# EAGLE board Front ECU rev7 (EAGLE 8.3.1)
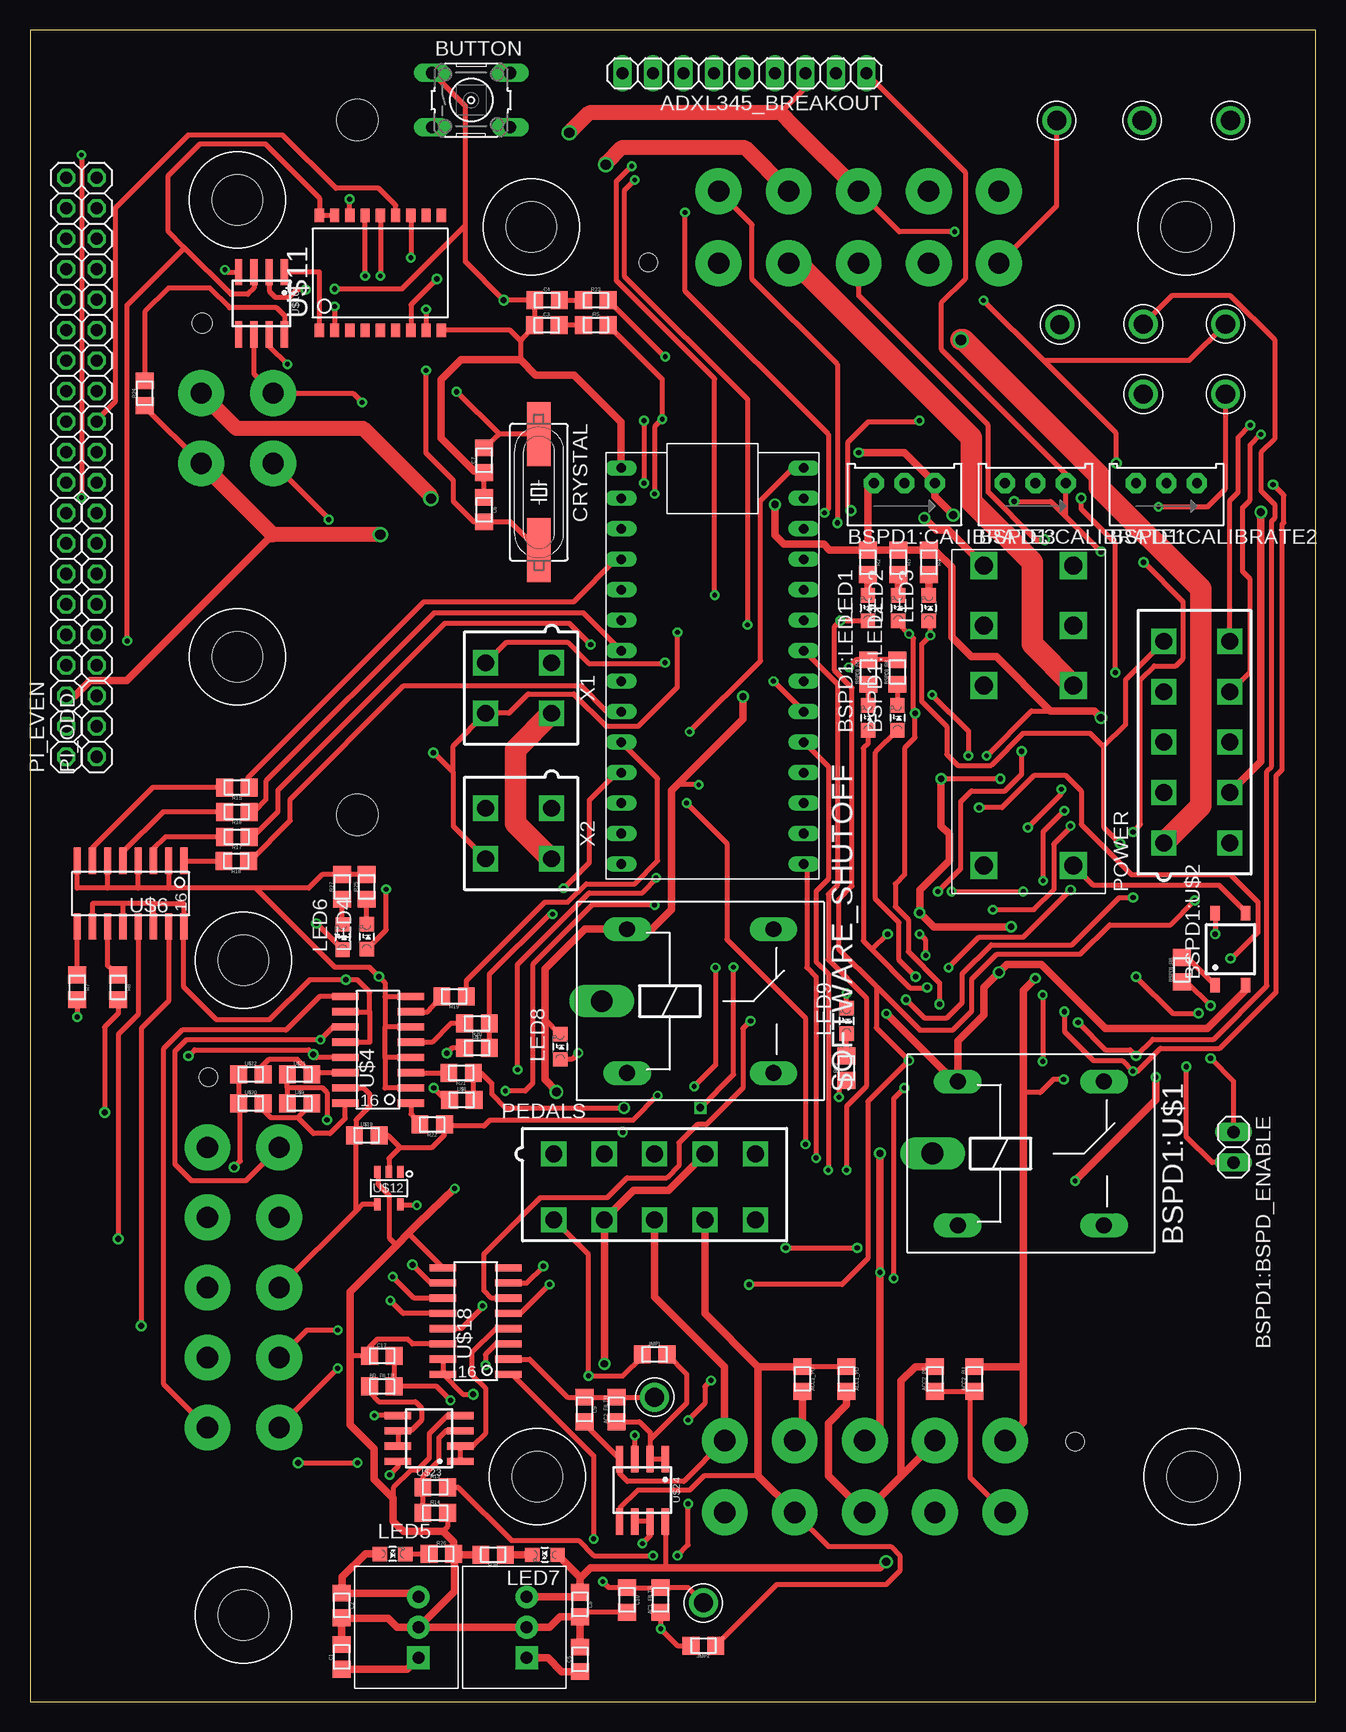
[diagram p2: board, top side]
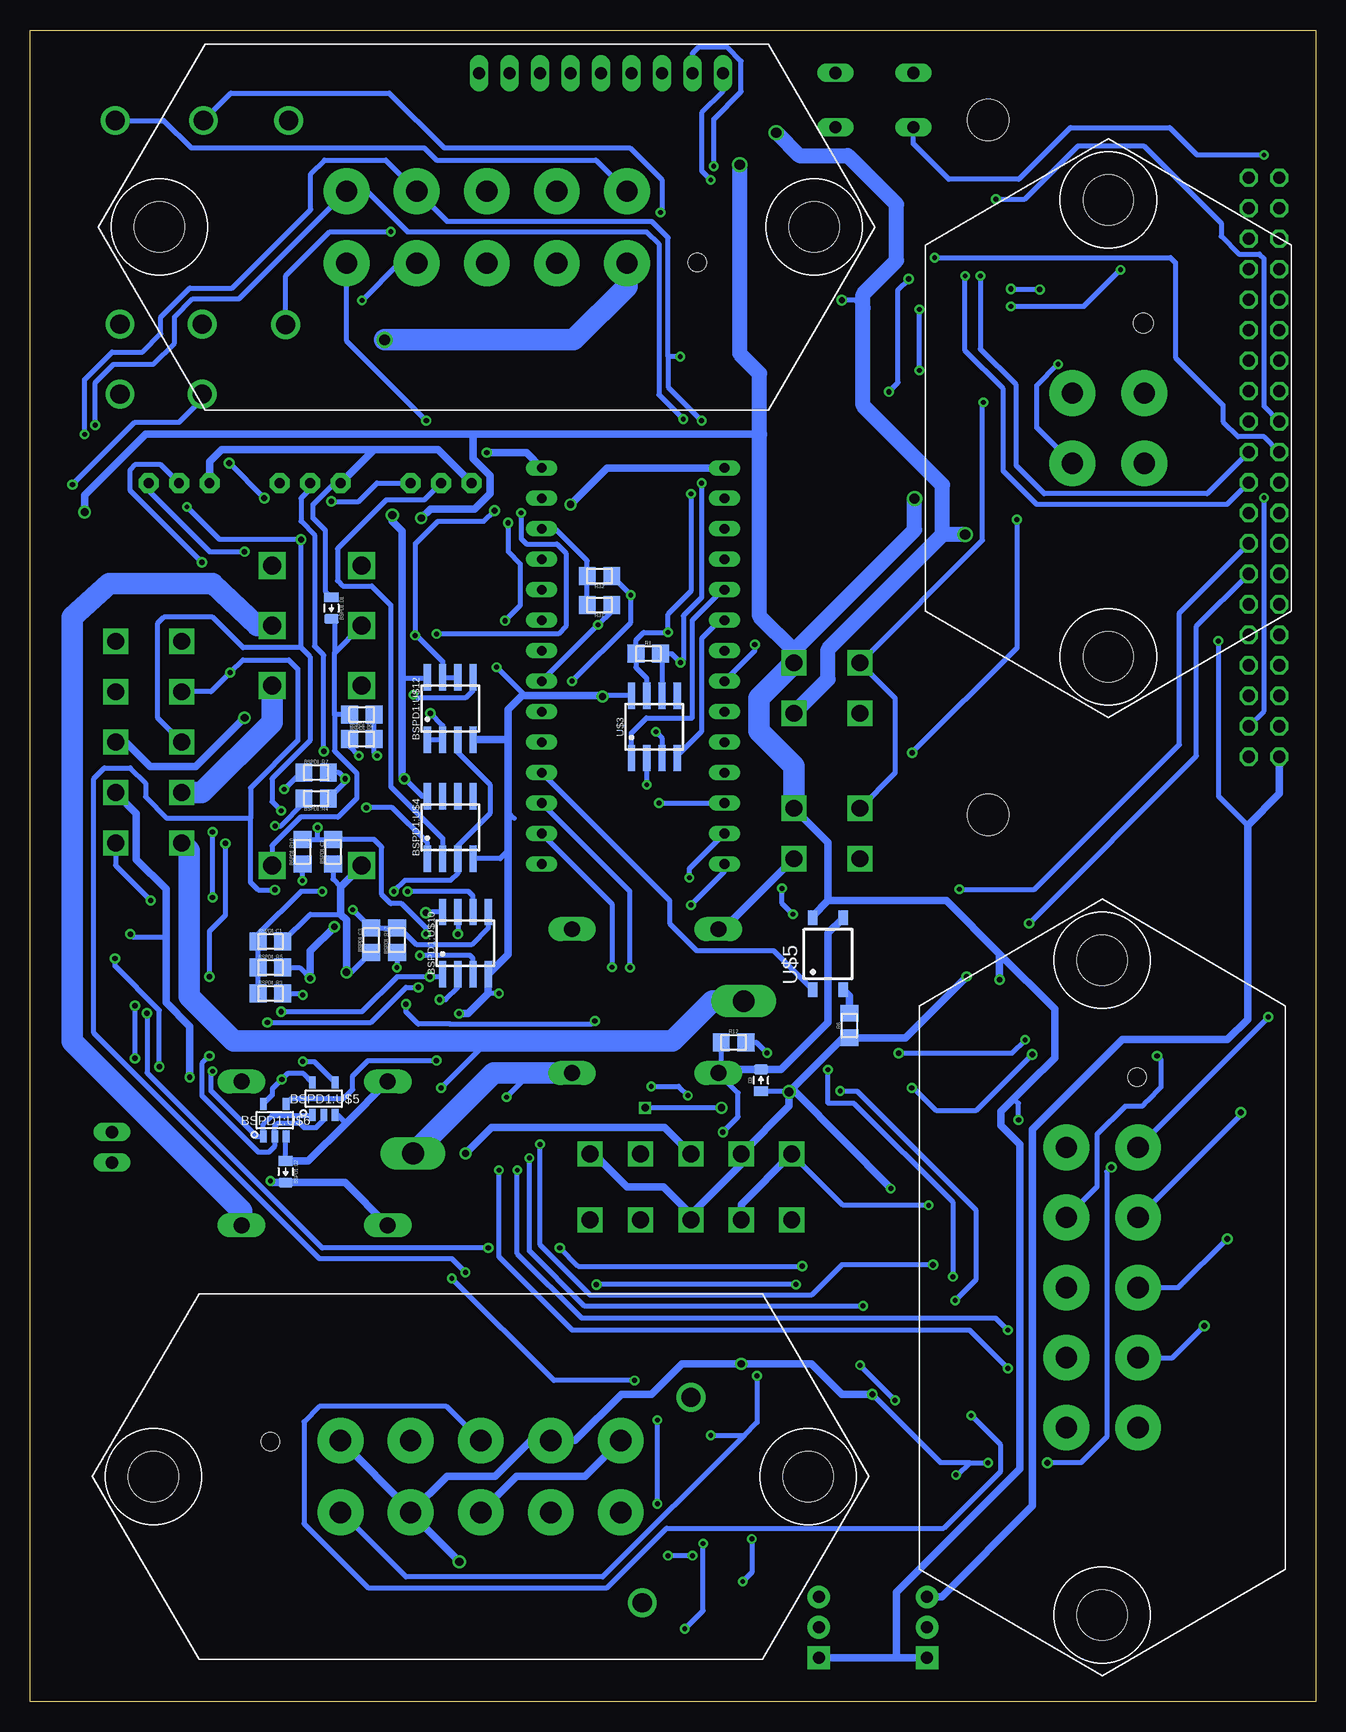
[diagram p3: board, bottom side, seen from below]

Size 107.17 x 139.37 mm. Coordinates in mm from the lower left corner, seen from the top.
Outline: 0,0 107.17,0 107.17,139.37 0,139.37 0,0
Copper layers (1*16): Top 0.035mm / dielectric 1.5mm / Bottom 0.035mm
Design rules "DRC Advanced Circuits": minimum track width 6mil, minimum drill 15mil, track to track 6mil, track to pad 6mil, pad to pad 6mil, via to via 6mil, smd to smd 6mil, copper to edge 40mil, drill to drill 6mil, minimum pad ring 10mil, minimum via ring 8mil, stop-mask expansion 4mil, vias tented up to drill 0mil, thermal gap 10mil
Holes 3.43 mm at 27.28,131.88 27.28,73.96
tKeepout: area 23,69.7 to 31.4,78.1; area 23.1,127.6 to 31.5,136

## Footprints (pad centres in the part's own frame; a part is rotated, then mirrored left to right if it is on the bottom)
0805 = smd 1.4 x 1.5: 1 -1.025,0; 2 1.025,0
1X09 = drill 1.016 long: 1 -8.89,0; 2 -6.35,0; 3 -3.81,0; 4 -1.27,0; 5 1.27,0; 6 3.81,0; 7 6.35,0; 8 8.89,0; 9 11.43,0
1X02 = drill 1.016 long: 1 -1.27,0; 2 1.27,0
TRIMPOT_3296 = drill 0.813 pad 1.676 octagon: 1 2.54,1.27; 2 0,1.27; 3 -2.54,1.27
0805_D = smd 0.8 x 1.2: A -0.9,0; C 0.9,0
LED-805 = smd 1.2 x 1.2: A 0,-1.05; C 0,1.05
ZF112 = drill 1.321 long: 1 4.064,14.884; 2 4.064,2.896; O 16.256,14.884; S 16.256,2.896 | drill 1.803 long: P 1.956,8.89
SOP04 = smd 0.8 x 1.2: 1 -1.27,-3; 2 1.27,-3; 3 1.27,3; 4 -1.27,3
JW2SN = drill 1.5 square: 2 10.008,0; 3 5.004,0; 4 0,0; 5 0,7.493; 6 5.004,7.493; 7 10.008,7.493; COIL+ 25.019,0; COIL- 25.019,7.493
SOIC-08 = smd 0.6 x 2.2: 1 -1.905,-2.6; 2 -0.635,-2.6; 3 0.635,-2.6; 4 1.905,-2.6; 5 1.905,2.6; 6 0.635,2.6; 7 -0.635,2.6; 8 -1.905,2.6
SOT-23-5 = smd 1 x 0.55: 1 -1.35,0.95; 2 -1.35,0; 3 -1.35,-0.95; 4 1.35,-0.95; 5 1.35,0.95
TEST_POINT = drill 1.6: P$1 0,0
B3F-10XX = drill 1.016 long: 1 -3.251,2.261; 2 3.251,2.261; 3 -3.251,-2.261; 4 3.251,-2.261
HC49UP = smd 5.334 x 1.93: 1 -4.826,0; 2 4.826,0
OKI-78SR = drill 1 pad 1.88 square: 1 -2.54,0 | drill 1 pad 1.88: 2 0,0; 3 2.54,0
MINIFIT_5566-10 = drill 1.4 square: 1 8.4,-2.75; 2 4.2,-2.75; 3 0,-2.75; 4 -4.2,-2.75; 5 -8.4,-2.75; 6 8.4,2.75; 7 4.2,2.75; 8 0,2.75; 9 -4.2,2.75; 10 -8.4,2.75
1X20 = drill 1.016 octagon: 1 0,0; 2 2.54,0; 3 5.08,0; 4 7.62,0; 5 10.16,0; 6 12.7,0; 7 15.24,0; 8 17.78,0; 9 20.32,0; 10 22.86,0; 11 25.4,0; 12 27.94,0; 13 30.48,0; 14 33.02,0; 15 35.56,0; 16 38.1,0; 17 40.64,0; 18 43.18,0; 19 45.72,0; 20 48.26,0
TEENSY_3.2_SIMPLE = drill 0.8 long: 3.3V 16.51,29.21; A0 16.51,3.81; A1 16.51,6.35; A2 16.51,8.89; A3 16.51,11.43; A4 16.51,13.97; A5 16.51,16.51; A6 16.51,19.05; A7 16.51,21.59; A8 16.51,24.13; A9 16.51,26.67; AGND 16.51,31.75; D0(RX1) 1.27,31.75; D1(TX1) 1.27,29.21; D2 1.27,26.67; D3(CANTX) 1.27,24.13; D4(CANRX) 1.27,21.59; D5 1.27,19.05; D6 1.27,16.51; D7(RX3) 1.27,13.97; D8(TX3) 1.27,11.43; D9(RX2) 1.27,8.89; D10(TX2) 1.27,6.35; D11 1.27,3.81; D12 1.27,1.27; D13 16.51,1.27; GND 1.27,34.29; VIN 16.51,34.29
SOIC-16 = smd 0.6 x 2.2: 1 -4.445,-2.794; 2 -3.175,-2.794; 3 -1.905,-2.794; 4 -0.635,-2.794; 5 0.635,-2.794; 6 1.905,-2.794; 7 3.175,-2.794; 8 4.445,-2.794; 9 4.445,2.667; 10 3.175,2.667; 11 1.905,2.667; 12 0.635,2.667; 13 -0.635,2.667; 14 -1.905,2.667; 15 -3.175,2.667; 16 -4.445,2.667
SOIC-18W = smd 0.762 x 1.143: 1 -5.08,-4.788; 2 -3.81,-4.788; 3 -2.54,-4.788; 4 -1.27,-4.788; 5 0,-4.788; 6 1.27,-4.788; 7 2.54,-4.788; 8 3.81,-4.788; 9 5.08,-4.788; 10 5.08,4.788; 11 3.81,4.788; 12 2.54,4.788; 13 1.27,4.788; 14 0,4.788; 15 -1.27,4.788; 16 -2.54,4.788; 17 -3.81,4.788; 18 -5.08,4.788
MINIFIT_5566-4 = drill 1.4 square: 1 2.1,-2.75; 2 -2.1,-2.75; 3 2.1,2.75; 4 -2.1,2.75
MX150L_VERTICAL-4 = drill 1.778 pad 3.81: 1 -2.921,2.997; 2 2.921,2.997; 3 -2.921,-2.997; 4 2.921,-2.997 | hole 4.191: -19.05,0; 19.05,0 | hole 1.651: -8.763,2.921
MX150L_VERTICAL-10 = drill 1.778 pad 3.81: 1 -11.684,2.997; 2 -5.842,2.997; 3 0,2.997; 4 5.842,2.997; 5 11.684,2.997; 6 -11.684,-2.997; 7 -5.842,-2.997; 8 0,-2.997; 9 5.842,-2.997; 10 11.684,-2.997 | hole 4.191: -27.292,0; 27.292,0 | hole 1.524: -17.526,2.921

## Placement (x,y rotation side)
AC1_FILTR  510  [0805]  52.58,8.51 90 top
AC2_FILTR  510  [0805]  48.9,24.38 90 top
ACC1_PD  10k  [0805]  68.07,26.92 270 top
ACC1_PU  10k  [0805]  64.39,26.92 270 top
ACC2_PD  10k  [0805]  75.44,26.92 90 top
ACC2_PU  10k  [0805]  78.74,26.92 90 top
ADXL345_BREAKOUT  [1X09]  60.83,135.76 180 top
BR_FILTR  100  [0805]  29.34,26.29 0 top
BSPD1:BSPD_ENABLE  JUMPER  [1X02]  100.33,46.23 270 top
BSPD1:C1  .47µ  [0805]  87.12,63.37 0 bottom
BSPD1:C2  2.2µ  [0805]  81.92,70.87 90 bottom
BSPD1:C3  2.2µ  [0805]  78.74,63.5 90 bottom
BSPD1:CALIBRATE1  [TRIMPOT_3296]  83.82,100.33 0 top
BSPD1:CALIBRATE2  [TRIMPOT_3296]  94.74,100.33 0 top
BSPD1:CALIBRATE3  [TRIMPOT_3296]  72.9,100.33 0 top
BSPD1:D1  DIODE0805  [0805_D]  82.04,91.19 270 bottom
BSPD1:D2  DIODE0805  [0805_D]  85.85,44.2 270 bottom
BSPD1:LED1  RED  [LED-805]  69.88,82.04 0 top
BSPD1:LED2  YELLOW  [LED-805]  72.31,82.04 0 top
BSPD1:R1  12k  [0805]  79.5,80.26 0 bottom
BSPD1:R2  43k  [0805]  79.5,82.3 180 bottom
BSPD1:R3  330  [0805]  87.12,59.05 0 bottom
BSPD1:R4  10k  [0805]  83.31,75.31 180 bottom
BSPD1:R5  680k  [0805]  87.12,61.21 0 bottom
BSPD1:R6  680  [0805]  96.01,61.04 90 top
BSPD1:R7  10k  [0805]  83.31,77.47 0 bottom
BSPD1:R8  270  [0805]  72.31,85.85 90 top
BSPD1:R9  270  [0805]  69.88,85.85 90 top
BSPD1:R10  100  [0805]  84.45,70.87 90 bottom
BSPD1:R12  100  [0805]  76.58,63.5 90 bottom
BSPD1:U$1  G5LE  [ZF112]  73.28,36.83 0 top
BSPD1:U$2  CPC1002N  [SOP04]  100.08,62.74 0 top
BSPD1:U$3  JW2SN-DC12V  [JW2SN]  79.5,94.74 270 top
BSPD1:U$4  MCP6542SOIC  [SOIC-08]  72.14,72.9 0 bottom
BSPD1:U$5  SN74AHC1G09  [SOT-23-5]  82.68,50.29 90 bottom
BSPD1:U$6  SN74LVC1G08  [SOT-23-5]  86.77,48.49 90 bottom
BSPD1:U$10  MCP6542SOIC  [SOIC-08]  70.87,63.25 0 bottom
BSPD1:U$11  TEST_POINT  [TEST_POINT]  92.81,114.86 0 top
BSPD1:U$12  MCP6002SOIC  [SOIC-08]  72.14,82.8 0 bottom
BSPD1:U$13  TEST_POINT  [TEST_POINT]  92.81,109.02 0 top
BUTTON  [B3F-10XX]  36.78,133.53 0 top
C1  10uF  [0805]  25.98,3.76 90 top
C2  10uF  [0805]  25.98,8.05 270 top
C3  560pF  [0805]  43.08,114.76 0 top
C4  560pF  [0805]  43.1,116.84 0 top
C5  10uF  [0805]  45.85,3.56 90 top
C6  22pF  [0805]  37.87,99.39 270 top
C7  22pF  [0805]  37.87,103.5 90 top
C8  10uF  [0805]  45.85,8.13 270 top
C9  22µ  [0805]  46.23,24.38 270 top
C10  22µ  [0805]  49.78,8.51 270 top
C12  2.2µ  [0805]  29.34,28.83 0 top
CRYSTAL  16MHz  [HC49UP]  42.42,100.84 270 top
D3  DIODE0805  [0805_D]  46.23,51.82 90 bottom
IC2  OKI-78SR  [OKI-78SR]  32.38,6.22 90 top
IC3  OKI-78SR  [OKI-78SR]  41.4,6.22 90 top
JMP1  0  [0805]  52.07,28.96 0 top
JMP2  0  [0805]  56.13,4.7 180 top
LED1  RED  [LED-805]  69.85,91.19 0 top
LED2  YELLOW  [LED-805]  72.39,91.19 0 top
LED3  GREEN  [LED-805]  74.93,91.19 0 top
LED4  GREEN  [LED-805]  28.07,63.78 0 top
LED5  PURPLE  [LED-805]  30.23,12.34 270 top
LED6  RED  [LED-805]  26.06,63.75 0 top
LED7  PURPLE  [LED-805]  42.93,12.27 90 top
LED8  RED  [LED-805]  44.2,54.61 0 top
LED9  RED  [LED-805]  68.07,56.77 0 top
PEDALS  MINIFIT_5566-10  [MINIFIT_5566-10]  52.07,42.93 180 top
PI_EVEN  [1X20]  3.02,78.79 90 top
PI_ODD  [1X20]  5.56,78.79 90 top
POWER  MINIFIT_5566-10  [MINIFIT_5566-10]  97.28,80.01 270 top
R1  120  [0805]  55.63,87.38 0 bottom
R2  270  [0805]  69.85,95 270 top
R3  270  [0805]  72.39,95 270 top
R4  200  [0805]  74.93,95 270 top
R5  100  [0805]  47.17,114.78 0 top
R6  330  [0805]  38.86,56.39 90 bottom
R7  0  [0805]  3.94,59.56 270 top
R8  0  [0805]  7.37,59.56 270 top
R12  1.2K  [0805]  48.51,54.99 0 bottom
R13  43k  [0805]  33.78,17.91 0 top
R14  12k  [0805]  33.78,15.75 0 top
R15  270  [0805]  17.25,76.23 180 top
R16  270  [0805]  17.25,74.19 180 top
R17  270  [0805]  17.25,72.11 180 top
R18  270  [0805]  17.2,70.1 180 top
R19  270  [0805]  35.36,58.83 180 top
R20  270  [0805]  37.26,56.54 180 top
R21  270  [0805]  35.94,52.45 180 top
R22  270  [0805]  33.53,48.13 180 top
R23  100  [0805]  47.17,116.84 0 top
R24  4.7k  [0805]  9.58,109.09 90 top
R25  200  [0805]  28.07,67.94 90 top
R26  200  [0805]  34.29,12.34 0 top
R27  270  [0805]  26.04,67.94 90 top
R28  200  [0805]  38.61,12.27 180 top
R29  1.2K  [0805]  68.07,52.83 90 top
R31  4.7k  [0805]  59.69,91.44 180 bottom
R32  4.7k  [0805]  59.69,93.85 180 bottom
SOFTWARE_SHUTOFF  G5LE  [ZF112]  45.72,49.53 0 top
U$1  TEENSY_3.2_SIMPLE  [TEENSY_3.2_SIMPLE]  48.01,68.58 0 top
U$2  TEST_POINT  [TEST_POINT]  85.85,114.81 0 top
U$3  MCP2551  [SOIC-08]  55.12,81.28 0 bottom
U$4  TLP291-4  [SOIC-16]  28.96,54.36 90 top
U$5  CPC1002N  [SOP04]  40.64,62.36 0 bottom
U$6  TLP291-4  [SOIC-16]  8.38,67.31 180 top
U$7  JUMPER  [0805]  37.26,54.51 0 top
U$8  JUMPER  [0805]  35.99,50.19 0 top
U$9  JUMPER  [0805]  22.48,49.91 0 top
U$10  MCP2551  [SOIC-08]  19.3,116.59 180 top
U$11  MCP2515SMD  [SOIC-18W]  29.21,119.13 0 top
U$12  SN74LV1T34  [SOT-23-5]  29.92,42.82 270 top
U$13  TEST_POINT  [TEST_POINT]  99.67,114.86 0 top
U$14  TEST_POINT  [TEST_POINT]  99.67,109.02 0 top
U$15  TEST_POINT  [TEST_POINT]  85.6,131.83 0 top
U$16  TEST_POINT  [TEST_POINT]  92.71,131.83 0 top
U$17  TEST_POINT  [TEST_POINT]  100.08,131.83 0 top
U$18  MCP3208SOIC  [SOIC-16]  37.08,31.75 90 top
U$19  JUMPER  [0805]  28.07,47.24 0 top
U$20  JUMPER  [0805]  18.41,49.91 0 top
U$21  JUMPER  [0805]  22.48,52.32 0 top
U$22  JUMPER  [0805]  18.41,52.32 0 top
U$23  MCP6002SOIC  [SOIC-08]  33.27,21.97 90 top
U$24  MCP6002SOIC  [SOIC-08]  51.05,17.65 180 top
U$25  TEST_POINT  [TEST_POINT]  52.07,25.4 0 top
U$26  TEST_POINT  [TEST_POINT]  56.13,8.26 0 top
X1  CONNECTOR-4  [MINIFIT_5566-4]  40.74,84.51 90 top
X2  CONNECTOR-4  [MINIFIT_5566-4]  40.74,72.39 90 top
X3  CONNECTOR-4MX150L_VERTICAL-4  [MX150L_VERTICAL-4]  17.27,106.17 270 bottom
X4  CONNECTOR-10MX150L_VERTICAL-10  [MX150L_VERTICAL-10]  69.6,18.8 0 bottom
X5  CONNECTOR-10MX150L_VERTICAL-10  [MX150L_VERTICAL-10]  69.09,122.94 180 bottom
X6  CONNECTOR-10MX150L_VERTICAL-10  [MX150L_VERTICAL-10]  17.78,34.54 270 bottom

## Tracks (layer width: path | path; a pad name or v marks a point on that pad's centre or on a via)
3.3V+
  Bottom 0.406: U$1.3.3V 63.38,97.79 60.72,95.12 R32.2 R31.2
+5V  (via drill 0.4, 0.45, 0.5, 0.55, 0.6, 0.7)
  Top 0.406: X4.1 81.28,21.84 | 82.8,50.8 84.23,50.8 85.32,51.89 v86.18,51.89 | U$18.15 U$18.16 36.07,25.65 v36.96,25.65 | v17.02,44.58 17.53,45.09 17.53,49.77 U$20.1 U$22.1 | 86.36,98.81 v89.28,95.89 | 86.36,98.81 BSPD1:CALIBRATE1.1 86.36,102.36 75.95,112.78 75.95,116.59 77.98,118.62 77.98,127.51 ADXL345_BREAKOUT.1 | v82.04,100.08 85.09,100.08 86.36,98.81 | v75.95,76.96 v80.9,76.96 | v22.35,19.94 v27.3,19.94 | U$23.8 30.67,19.62 v29.97,18.92 | U$1.VIN 63.61,102.87 61.07,100.33 61.07,100.31 60.9,100.14 60.9,86.78 v54.99,80.87 | U$24.8 52.96,11.18 | v32.26,41.4 30.94,41.4 U$12.5
  Top 0.61: v69.09,104.14 72.9,104.14 BSPD1:CALIBRATE3.1 75.44,100.46 v76.96,98.93 | X4.1 82.8,23.32 82.8,27.81 | 82.8,27.81 82.8,50.8 82.8,59.31 v83.82,60.33 | v81.79,64.62 75.34,64.62 v74.17,65.79 74.17,67.69 76.63,70.16 76.63,72.34 75.95,73.03 v75.95,76.96 | PEDALS.4 53.22,42.62 50.31,42.62 PEDALS.7 47.88,40.17 v47.88,28.19 | 45.85,10.4 LED7.A | 45.85,10.4 C8.1 45.46,8.76 IC3.3 | ACC1_PU.2 64.39,22.43 X4.4 | ACC2_PU.2 82.67,27.95 82.8,27.81 | v71.37,11.68 70.87,11.18 52.96,11.18 46.74,11.18 45.96,10.4 45.85,10.4
  Bottom 0.406: BSPD1:U$12.8 74.1,85.34 76.15,85.34 | BSPD1:U$10.8 73.91,65.85 v74.17,65.79 | BSPD1:U$4.8 74.17,75.5 | BSPD1:U$5.5 84.36,52.38 85.7,52.38 v86.18,51.89 86.96,51.11 86.96,50.59 BSPD1:U$6.5 | v17.02,44.58 17.4,44.2 17.4,22.1 19.56,19.94 v22.35,19.94 | BSPD1:CALIBRATE2.1 97.28,100.97 92.2,95.89 v89.28,95.89 | v82.04,100.08 79.76,100.08 78.23,101.6 BSPD1:CALIBRATE3.1 | BSPD1:U$4.8 74.04,74.68 | v75.95,76.96 74.48,75.5 BSPD1:U$4.8 | 28.83,19.94 v27.3,19.94 | 28.83,19.94 31.24,19.94 v36.96,25.65 | BSPD1:R5.2 84.71,61.21 v83.82,60.33 | v29.97,18.92 29.84,18.92 28.83,19.94 | v54.99,80.87 54.48,80.37 U$3.3 | BSPD1:R7.2 81.41,77.47 v80.9,76.96 80.9,76.7 BSPD1:R4.1 | PEDALS.1 39.4,41.4 v32.26,41.4
  Bottom 0.61: PEDALS.7 47.87,41.48 PEDALS.1 | X4.7 72.42,18.82 68.38,18.82 65.41,21.79 X4.4 61.72,21.79 57.86,25.65 55.37,25.65 52.83,28.19 v47.88,28.19 42.04,28.19 39.5,25.65 v36.96,25.65 | X4.7 75.44,15.95 X4.1 | U$1.VIN 65.79,104.14 v69.09,104.14 | v75.95,76.96 76.15,77.17 76.15,85.34 76.15,97.61 76.96,98.42 v76.96,98.93 | v71.37,11.68 75.44,15.75 X4.7 | v81.79,64.62 83.82,62.59 v83.82,60.33
+5V/1  (via drill 0.4)
  Top 0.406: 24.09,123.95 U$11.18 | U$11.18 U$11.17 | U$11.18 24.13,125.35 19.61,129.87 14.17,129.87 11.53,127.23 11.53,122.58 12.83,121.28 | v8.1,88.44 8.1,116.43 12.83,121.16 12.83,121.28 | U$10.3 18.67,117.86 18.16,117.35 16.76,117.35 12.83,121.28
  Top 0.61: IC2.3 32.07,9.08 C2.1 26.04,9.13 26.04,10.41 27.96,12.34 LED5.A
  Bottom 0.406: v8.1,88.44 8.1,75.51 5.66,73.08
  Bottom 0.61: PI_EVEN.1 3.02,75.72 5.66,73.08 5.66,56.9 7.34,55.22 16.1,55.22 23.6,47.73 23.6,16.33 31.17,8.76 IC2.3
+12V  (via drill 0.4, 0.45, 0.6, 0.65, 0.85)
  Top 0.406: 10.41,66.55 10.29,66.42 U$6.14 | 10.41,66.55 7.75,66.55 | U$4.12 28.32,54.99 28.32,57.53 | 10.41,66.55 12.83,66.55 U$6.16 12.83,59.59 15.53,56.88 19.98,56.88 23.29,60.2 v26.34,60.2 27.3,60.2 28.32,59.18 28.32,57.53 | 7.75,66.55 U$6.12 | U$6.10 5.21,66.55 7.75,66.55 | U$4.10 28.32,57.53 | 21.45,51.18 U$9.1 | 21.45,51.18 U$21.1 | v24.77,48.51 24.77,50.8 24.4,51.17 21.47,51.17 21.45,51.18 | BSPD1:U$2.4 v98.81,64.01
  Top 0.61: v87.12,43.43 93.85,50.16 v93.85,52.07 | POWER.7 102.62,78.39 v102.62,99.19 | C5.1 44.32,2.53 43.17,3.68 IC3.1 | C1.1 31.44,2.73 IC2.1 | BSPD1:U$3.4 76.58,97.66 75.56,97.66 v74.55,98.68
  Top 1.27: v33.43,100.31 33.43,100.51 27.76,106.17 17.2,106.17 X3.1 | X5.7 59.64,129.54 49.28,129.54 48.01,128.27 v48.01,128.14
  Bottom 0.406: 23.81,51.5 23.94,51.5 | v24.77,48.51 24.77,49.91 25.15,50.29 | v98.81,64.01 98.55,63.75 95.83,63.75
  Bottom 0.61: 70.23,105.66 46.35,105.66 | 70.23,105.66 97.54,105.66 102.62,100.58 v102.62,99.19 | X2.1 40.64,71.64 40.64,66.8 | 40.64,66.8 41.91,65.53 U$5.4 | 26.34,62.36 v26.34,60.2 | 26.34,62.36 21.74,57.76 21.74,53.7 23.94,51.5 25.15,50.29 26.23,49.21 26.23,48.07 24.64,46.48 24.64,19.43 34.92,9.14 34.92,3.68 | 26.34,62.36 30.79,66.8 40.64,66.8 | POWER.7 98.3,74.08 98.3,70.23 95.83,67.77 95.83,63.75 95.83,58.29 93.85,56.31 v93.85,52.07 | BSPD1:U$1.2 80.91,43.3 BSPD1:D2.C 86.98,43.3 v87.12,43.43 | IC3.1 34.92,3.68 | 34.92,3.68 IC2.1 | v74.55,98.68 73.79,99.44 70.1,99.44 68.83,100.71 68.83,102.23 70.23,103.63 70.23,105.66
  Bottom 1.27: 43.49,87.62 33.43,97.69 v33.43,100.31 | 43.49,87.62 X1.1 | 43.49,87.62 46.35,90.49 46.35,105.66 46.35,110.74 48.01,112.39 v48.01,128.14
  Bottom 1.778: X1.1 46.41,83.7 46.41,80.95 43.49,78.04 X2.1
BSPD1:N$1
  Top 0.406: BSPD1:U$3.COIL- 88.65,68.07 99.14,68.07 101.35,65.86 BSPD1:U$2.3
  Bottom 0.406: 81.79,82.3 81.79,79.27 79.93,77.42 79.93,75.31 81.5,73.75 84.62,73.75 87,71.37 BSPD1:U$3.COIL- | 81.79,82.3 81.79,87.45 | BSPD1:D1.C 81.79,90.03 81.79,87.45 | 81.79,87.45 BSPD1:U$3.3 | BSPD1:R2.2 81.79,82.3
BSPD1:N$2  (via drill 0.4)
  Top 0.406: v84.43,58.93 v84.43,53.39
  Bottom 0.406: v84.43,53.39 83.48,53.39 BSPD1:U$5.4 | BSPD1:R3.2 84.56,59.05 v84.43,58.93
BSPD1:N$3
  Top 0.406: BSPD1:R6.2 96.48,62.06 BSPD1:U$2.1
BSPD1:N$4  (via drill 0.45)
  Top 0.406: BSPD1:R6.1 96.45,60.01 v98.42,58.04 | v98.42,53.65 100.33,51.74 BSPD1:BSPD_ENABLE.1
  Bottom 0.406: v98.42,58.04 v98.42,53.65
BSPD1:N$5  (via drill 0.45)
  Top 0.406: v73.03,58.55 74.55,57.02 76.45,57.02 77.72,58.29 77.72,60.71 80.14,63.12 86.87,63.12 90.81,67.06 v91.95,67.06 | v91.95,72.52 92.58,73.15 92.58,85.22 93.73,86.36 95.5,86.36 96.14,87 96.14,91.69 v92.84,95
  Bottom 0.406: BSPD1:CALIBRATE2.2 96.27,103.12 98.42,103.12 98.81,102.74 98.81,100.97 v92.84,95 | BSPD1:U$10.2 71.5,59.56 72.52,58.55 v73.03,58.55 | v91.95,67.06 v91.95,72.52
BSPD1:N$6  (via drill 0.4, 0.45)
  Top 0.406: v82.68,79.25 82.68,77.34 81.28,75.95 78.49,75.95 77.6,75.06 77.6,69.47 v75.69,67.56
  Bottom 0.406: BSPD1:CALIBRATE1.2 83.82,101.09 84.58,100.33 84.58,98.42 83.44,97.28 83.44,88.01 82.68,87.25 v82.68,79.25 | BSPD1:U$10.6 70.23,67.18 70.61,67.56 v75.69,67.56
BSPD1:N$7
  Bottom 0.406: BSPD1:U$4.2 72.77,71.98 77.09,76.3 77.09,91.44 78.68,93.03 81.09,93.03 81.53,93.47 81.53,96.14 77.47,100.2 74.3,100.2 BSPD1:CALIBRATE3.2
BSPD1:N$8  (via drill 0.45)
  Top 0.406: v79.12,74.55 81.03,74.55 83.69,77.22 86.36,77.22 87.63,75.95 87.63,73.15 91.82,68.96 100.08,68.96 102.36,66.67 102.36,64.14 100.2,61.98 v100.08,61.98 | BSPD1:BSPD_ENABLE.2 98.55,44.96 96.39,47.12 v96.39,52.96
  Bottom 0.406: BSPD1:U$4.1 74.04,71.63 76.96,74.55 v79.12,74.55 | v96.39,52.96 96.39,57.66 100.08,61.34 v100.08,61.98
BSPD1:N$9  (via drill 0.4)
  Top 0.406: v75.2,83.95 78.23,80.92 v78.23,78.87
  Bottom 0.406: BSPD1:R2.1 BSPD1:R1.2 78.48,79.11 v78.23,78.87 | BSPD1:U$12.5 70.23,84.33 70.87,83.69 74.93,83.69 75.18,83.95 v75.2,83.95
BSPD1:N$13  (via drill 0.4)
  Top 0.406: v76.83,67.56 v82.8,67.56
  Bottom 0.406: BSPD1:U$12.3 71.5,79.12 68.83,76.45 68.83,74.07 71.5,71.4 BSPD1:U$4.3 71.5,69.06 72.08,68.48 72.1,68.49 75.91,68.49 v76.83,67.56 | BSPD1:R3.1 BSPD1:R5.1 BSPD1:C1.1 88.15,64 84.58,67.56 v82.8,67.56
BSPD1:N$14
  Top 0.406: BSPD1:R8.1 BSPD1:LED2.C
BSPD1:N$15
  Top 0.406: BSPD1:LED1.C BSPD1:R9.1
BSPD1:N$16  (via drill 0.45)
  Top 0.406: BSPD1:LED1.A 69.88,79.91 69.47,79.5 69.47,63.44 70.2,62.71 | v87.38,56.64 89.66,54.36 91.69,54.36 v92.2,53.85 93.6,55.24 98.68,55.24 103.12,59.69 103.12,77.6 103.5,77.98 103.5,98.42 103.76,98.68 103.76,99.82 102.62,100.97 102.62,104.14 103.76,105.28 103.76,113.54 100.08,117.22 95.17,117.22 BSPD1:U$11.P$1 | v74.8,59.56 74.77,59.53 73.37,59.53 70.2,62.71 | v71.5,64.01 70.2,62.71
  Bottom 0.406: BSPD1:U$5.2 82.68,48.51 83.31,47.88 84.33,47.88 84.71,48.26 86.49,48.26 86.77,47.98 BSPD1:U$6.2 86.74,47.11 86.74,46.35 87.25,45.85 88.14,45.85 92.84,50.55 92.84,53.21 v92.2,53.85 | v87.38,56.64 78.74,56.64 75.82,59.56 v74.8,59.56 | BSPD1:U$10.7 v71.5,64.01
BSPD1:N$17  (via drill 0.4, 0.45)
  Top 0.406: BSPD1:LED2.A 70.48,79.16 70.48,66.93 72.45,64.96 72.45,61.84 v73.84,60.45 | v86.23,57.53 86.23,55.88 88.65,53.47 91.06,53.47 v91.95,52.58 92.33,52.58 94.23,54.48 99.19,54.48 103.89,59.18 103.89,77.22 104.39,77.72 104.39,98.17 104.52,98.3 104.52,100.58 v103.63,101.47
  Bottom 0.406: BSPD1:U$5.1 83.67,48.9 87,48.9 87.72,48.17 BSPD1:U$6.1 88.29,47.14 92.08,50.93 92.08,52.45 v91.95,52.58 | 72.77,60.33 BSPD1:U$10.1 72.97,60.45 v73.84,60.45 76.58,60.45 79.5,57.53 v86.23,57.53 | v103.63,101.47 98.42,106.68 94.74,106.68 92.81,108.61 BSPD1:U$13.P$1
BSPD1:SHUTDOWN_C
  Bottom 1.778: BSPD1:U$3.6 88.21,89.74 91.95,93.22 100.58,93.22 103.63,90.42 103.63,55.04 89.53,40.95 BSPD1:U$1.S
BSPD1:SIGNAL_BRAKE_FILT  (via drill 0.4)
  Top 0.406: v80.26,66.04 83.69,66.04 85.34,67.69 85.34,71.5 86.74,72.9 v86.74,73.03
  Bottom 0.406: BSPD1:U$10.5 68.96,64.52 70.36,63.12 74.93,63.12 76.34,64.53 BSPD1:R12.2 BSPD1:C3.2 v80.25,66.04 v80.26,66.04 | v86.74,73.03 86.23,73.03 84.34,74.92 BSPD1:R4.2
BSPD1:SIGNAL_CURRENT_FILT  (via drill 0.4)
  Top 0.406: v74.68,62.23 74.68,63.5 v74.17,64.01 | v83.19,72.9 85.98,75.69 v85.98,76.07
  Bottom 0.406: BSPD1:U$10.3 70.23,61.98 70.48,62.23 v74.68,62.23 | v74.17,64.01 74.17,64.52 76.2,66.55 77.09,66.55 77.85,67.31 77.85,71.25 78.5,71.89 BSPD1:C2.2 83.19,71.89 | BSPD1:R10.2 83.19,71.89 | 83.19,71.89 v83.19,72.9 | BSPD1:R7.1 84.58,77.47 v85.98,76.07
BUT  (via drill 0.4)
  Top 0.406: v4.29,128.96 v4.29,100.38
  Bottom 0.406: PI_ODD.2 4.29,82.6 v4.29,100.38 | BUTTON.3 33.53,129.87 30.58,126.92 24.74,126.92 20.42,131.24 12.17,131.24 9.88,128.96 v4.29,128.96
CANH  (via drill 0.4, 0.45)
  Top 0.406: X2.4 35.28,73 35.28,77.5 | 35.28,77.5 35.28,79.7 X1.4 39.92,82.41 41.53,84.02 45.33,84.02 48.01,81.34 50.72,81.34 53.98,84.59 v53.98,89.15 | v33.63,79.12 35.26,77.5 35.28,77.5 | v52.07,100.71 52.07,106.3 v52.7,106.93 52.7,110.27 R5.2 | POWER.10 100.03,100.16 100.71,100.84 100.71,105.41 v101.73,106.43 | X3.4 24.89,98.63 v24.89,98.55 | U$10.7 19.94,113.03 v21.46,111.51
  Bottom 0.406: 33.63,79.15 v33.63,79.12 24.89,87.86 v24.89,98.55 | v52.7,106.93 54.74,108.97 54.74,121.54 55.75,122.56 75.69,122.56 79.07,125.93 X5.10 89.74,116.97 93.6,116.97 95.12,115.44 95.12,113.28 96.9,111.51 100.2,111.51 101.73,109.98 v101.73,106.43 | v52.07,100.71 52.07,92.58 53.98,90.68 v53.98,89.15 56.01,89.15 56.64,88.52 R1.1 56.65,86.24 55.75,85.34 U$3.7 | X3.4 23.24,106.22 23.24,109.73 v21.46,111.51
CANL  (via drill 0.4)
  Top 0.406: X1.3 39.67,88.29 44.86,88.29 46.58,86.57 52.86,86.57 v52.93,86.64 | v51.18,106.81 v51.18,101.6 | POWER.9 101.73,85.91 101.73,93.6 101.09,94.23 101.09,99.57 101.73,100.2 101.73,104.78 v102.62,105.66 | 47.75,117.28 R23.2 52.89,112.14 v52.96,112.14 | U$10.6 18.67,110.69 X3.3 26.92,109.09 v27.69,108.33
  Bottom 0.406: X2.3 35.02,77.46 35.02,83.65 X1.3 27.76,96.85 27.76,108.26 v27.69,108.33 | U$3.6 54.48,87.11 R1.2 53.67,87.38 v52.93,86.64 52.7,86.87 52.7,90.55 51.18,92.08 v51.18,101.6 | 53.98,112.14 53.98,122.05 55.35,123.42 72.42,123.42 X5.9 77.52,128.52 82.61,128.52 83.76,127.38 83.76,124.4 90.3,117.86 93.85,117.86 96.27,115.44 96.27,114.05 97.79,112.52 100.33,112.52 102.62,110.24 v102.62,105.66 | 53.98,112.14 53.98,109.6 v51.18,106.81 | v52.96,112.14 53.98,112.14
CS  (via drill 0.4)
  Top 0.406: U$11.16 26.64,123.94 v26.64,125.27
  Bottom 0.406: v26.64,125.27 24.23,125.27 19.79,129.72 14.33,129.72 7.87,123.27 7.87,122.17 6.4,120.7 4.67,120.7 4.29,120.32 4.29,108 PI_EVEN.12
CS_MCP3208  (via drill 0.4, 0.5)
  Top 0.406: U$18.10 33.4,34.92 v31.88,36.45 | v64.64,46.48 64.64,57.02 58.1,63.56 58.1,71.56 v54.74,74.93
  Bottom 0.406: v64.64,46.48 64.64,38.1 60.45,33.91 42.04,33.91 39.5,36.45 v31.88,36.45 | v54.74,74.93 U$1.D10(TX2)
DASH_CTRL1
  Top 0.406: U$1.D2 48.87,95.25 45.31,91.69 32.82,91.69 18.15,77.02 R15.1
DASH_CTRL2
  Top 0.406: R16.1 18.64,74.19 19.66,75.21 19.66,76.76 33.68,90.78 46.13,90.78 U$1.D5
DASH_CTRL3  (via drill 0.45)
  Top 0.406: v46.74,88.14 44.96,89.92 34.59,89.92 20.68,76 20.68,74.22 18.57,72.11 R17.1
  Bottom 0.406: v46.74,88.14 46.74,87.63 U$1.D6
DASH_CTRL4
  Top 0.406: R18.1 18.34,70.1 21.69,73.46 21.69,75.23 31.17,84.71 45.92,84.71 48.08,82.55 U$1.D7(RX3)
DASH_CTRL5
  Top 0.406: R19.1 36.38,60.13 42.93,66.67 44.83,66.67 46.35,68.2 50.42,68.2 52.32,70.1 52.32,76.96 U$1.D8(TX3)
DASH_CTRL6  (via drill 0.4)
  Top 0.406: v44.48,67.82 46.61,69.95 46.61,75.16 48.92,77.47 U$1.D9(RX2) | U$7.2 R20.1 38.29,60.64 43.31,65.66 v43.56,65.66
  Bottom 0.406: v43.56,65.66 44.48,66.57 v44.48,67.82
DASH_CTRL7  (via drill 0.4, 0.6)
  Top 0.406: v49.53,49.53 39.62,49.53 38.48,50.67 38.48,51.56 37.59,52.45 R21.1 36.97,50.24 U$8.2 | v55.88,49.53 58.65,52.3 v58.65,61.24
  Bottom 0.406: v49.53,49.53 v55.88,49.53 | U$1.A0 58.65,66.52 v58.65,61.24
DASH_CTRL8  (via drill 0.4)
  Top 0.406: v57.15,61.21 57.15,53.09 v55.37,51.31 | U$12.2 29.92,45.29 30.86,46.23 | U$19.2 29.84,47.24 30.86,46.23 | v52.32,50.55 50.29,48.51 38.35,48.51 37.85,48.01 34.55,48.01 R22.1 34.55,47.25 33.53,46.23 30.86,46.23
  Bottom 0.406: v55.37,51.31 53.09,51.31 v52.32,50.55 | v57.15,61.21 57.15,67.56 U$1.A1
DASH_CTRL9  (via drill 0.4)
  Top 0.406: v66.55,44.32 66.55,60.71 65.53,61.72 65.53,67.56 66.55,68.58 66.55,77.98 U$1.A3 | v25.65,30.99 23.06,30.99 X6.9
  Bottom 0.406: v66.55,44.32 66.55,37.36 61.19,32 26.67,32 v25.65,30.99
DASH_CTRL10  (via drill 0.4)
  Top 0.406: v68.07,44.32 68.07,49.66 69.72,51.31 69.72,58.7 66.55,61.87 66.55,67.31 67.31,68.07 67.31,84.83 66.51,85.63 66.51,85.64 U$1.A6 | v25.65,27.81 20.78,22.94 X6.10
  Bottom 0.406: v68.07,44.32 68.07,37.11 61.96,31 28.84,31 v25.65,27.81
DASH_IO1  (via drill 0.4)
  Top 0.406: R7.2 v3.94,57.1
  Bottom 0.406: v3.94,57.1 3.94,57.07 X6.1
DASH_IO2  (via drill 0.5)
  Top 0.406: v6.22,49.15 6.22,56.26 7.37,57.4 R8.2
  Bottom 0.406: v6.22,49.15 6.22,48.95 X6.2
DASH_IO3  (via drill 0.5)
  Top 0.406: v7.37,38.61 7.37,55.65 9.02,57.3 U$6.13
  Bottom 0.406: v7.37,38.61 11.43,34.54 X6.3
DASH_IO4  (via drill 0.5)
  Top 0.406: v9.28,31.36 9.28,56.15 11.56,58.42 U$6.15
  Bottom 0.406: v9.28,31.36 11.94,28.7 X6.4
DASH_IO5
  Top 0.406: X6.5 11.11,26.53 11.11,54.42 12.7,56.01 21.34,56.01 24.13,58.8 U$4.9
DASH_IO6  (via drill 0.4, 0.45)
  Top 0.406: U$4.11 25.27,56.26 v24.21,55.19 13.03,55.19 12.06,54.23 12.06,44.83 13.46,43.43 17.98,43.43 X6.6 | U$7.1 35.18,54.51 v34.76,54.09
  Bottom 0.406: v34.76,54.09 25.31,54.09 v24.21,55.19
DASH_IO7  (via drill 0.45, 0.5)
  Top 0.406: v13.21,53.85 13.72,54.36 23.24,54.36 v23.62,53.98 23.88,53.72 U$4.13 | U$8.1 34.65,50.19 v33.66,51.18
  Bottom 0.406: X6.7 18.2,42.96 18.2,47.33 15.88,49.66 14.48,49.66 14.05,50.09 14.04,50.09 12.88,51.25 12.88,53.52 v13.21,53.85 | v33.66,51.18 33.5,51.18 31.6,49.28 28.32,49.28 v23.62,53.98
DASH_IO8
  Top 0.406: U$12.4 27.71,41.47 27.18,40.95 | 27.18,40.95 X6.8 | 26.42,51.18 U$4.15 27.81,51.18 28.32,50.67 28.32,49.66 27.18,48.51 27.18,47.23 | 27.18,47.23 U$19.1 | 27.18,40.95 27.18,47.23
GND  (via drill 0.4, 0.45, 0.5, 0.6, 0.65, 0.75, 0.85)
  Top 0.406: U$6.2 11.56,67.85 | 14.28,103.38 X3.2 9.58,107.95 R24.1 | 11.56,67.85 9.02,67.85 | 9.02,67.85 U$6.4 | 9.02,67.85 6.48,67.85 | 6.48,67.85 U$6.6 | 6.48,67.85 3.94,67.85 U$6.8 | C6.1 C7.1 | 27.62,68.84 R25.2 R27.2 24.36,68.97 23.24,67.85 18.82,67.85 | 19.94,119.89 U$10.2 19.94,117.6 20.45,117.09 21.59,117.09 22.23,117.73 v22.99,117.73 | 42.18,116.81 C4.1 | 40.89,113.47 40.89,111.89 | 41.95,114.64 40.89,113.47 | 41.95,114.64 C3.1 | U$11.9 40.03,114.34 40.89,113.47 | U$12.3 29.01,44.14 29.01,43.16 29.95,42.22 29.95,38.68 30.56,38.08 | BSPD1:R8.2 BSPD1:R9.2 68.89,86.88 v68.28,86.26 | 18.82,67.85 11.56,67.85 | BUTTON.1 36.3,133.02 36.3,123.11 | v25.4,117.78 30.96,117.78 36.3,123.11 | U$4.2 29.59,51.18 29.59,53.72 | 29.59,53.72 29.59,56.26 | 29.59,58.8 29.59,56.26 | 29.59,58.8 U$4.8 | U$4.6 29.59,56.26 | U$4.4 29.59,53.72 | 29.59,58.8 29.59,59.96 v29.08,60.47 28.29,61.27 25.4,61.27 18.82,67.85 | C4.1 v39.5,116.84 36.3,120.04 36.3,123.11 | 41.95,114.64 42.08,114.77 C4.1 | 53.47,74.17 53.47,73.66 | v55.75,76.45 53.95,76.45 53.47,75.97 | R14.2 34.81,14.61 34.43,14.24 | U$23.4 34.8,23.88 33.27,22.35 33.27,20.32 32.26,19.3 31.75,19.3 30.29,17.84 30.29,15.05 | LED8.C 42.93,56.93 42.93,57.15 | LED9.C v68.07,59.05 | v79.76,78.87 83.49,82.6 85.06,82.6 | 63.66,131.61 63.66,131.36 | v77.09,122.56 72.47,122.56 X5.8 | ADXL345_BREAKOUT.3 64.64,134.54 62.56,132.46 | X4.5 54.51,18.39 49.81,18.39 49.15,19.05 U$24.4 46.23,23.17 C9.2 | C10.2 46.23,7.48 C8.2 | U$18.9 31.61,39 31.61,39.13 | 26.67,28.83 C12.1 28.31,29.58 28.96,30.23 31.5,30.23 31.88,29.84 U$18.14
  Top 0.61: R2.1 R3.1 R4.1 75.53,95.9 76.83,94.59 76.83,88.77 78.49,87.12 80.54,87.12 85.06,82.6 88.72,82.6 v89.28,82.04 | X4.2 75.44,21.64 | 75.44,21.64 72.62,18.82 | 72.62,18.82 X4.8 66.55,18.85 66.55,23.24 68.07,24.77 ACC1_PD.2 | X4.5 57.91,27.94 52.07,33.78 PEDALS.8 | v59.44,83.82 59.44,81.94 53.47,75.97 53.47,73.66 53.47,66.04 51.84,64.41 SOFTWARE_SHUTOFF.1 46.25,64.41 42.93,61.09 42.93,57.15 42.93,51.89 43.92,50.9 v43.88,50.86 | v71.4,57.38 77.06,51.71 BSPD1:U$1.1 77.34,55.12 79.5,57.28 79.5,59.54 v80.78,60.82 81.43,61.47 84.3,61.47 89.64,56.13 98.15,56.13 101.35,59.33 BSPD1:U$2.2 | v62.1,99.82 62.1,97.28 62.87,96.52 66.17,96.52 66.67,96.02 R2.1 | R2.1 69.85,101.09 BSPD1:CALIBRATE3.3 | v35.41,42.8 32.37,39.89 31.61,39.13 30.56,38.08 26.67,34.19 26.67,28.83 26.67,23.11 28.7,21.08 28.7,18.54 30.29,16.95 30.29,15.05 30.73,14.61 31.13,14.24 34.43,14.24 35.31,13.35 R26.2 35.39,12.27 | 20.22,97.31 8.05,85.14 5.04,85.14 3.77,83.87 PI_EVEN.3 | C7.1 37.02,102.61 34.29,105.33 34.29,110.24 35.94,111.89 40.89,111.89 42.16,110.62 45.34,110.62 49.28,106.68 U$1.GND | R28.2 35.39,12.27 | C5.2 C8.2 44.19,7.1 43.31,6.22 IC3.2 IC2.2 | C1.2 C2.2 26.03,6.99 29.84,6.99 30.61,6.22 IC2.2 | 35.39,12.27 35.39,9.23 IC2.2 | 75.36,21.72 75.44,21.64 | ACC2_PD.2 73.8,27.95 72.62,26.77 72.62,18.82
  Top 1.27: X3.2 20.22,97.31 v29.21,97.31 | X5.8 63.66,131.36 62.56,132.46 46.61,132.46 v44.96,130.81
  Top 1.778: X1.2 40.46,79.39 40.46,73.22 43.39,70.29 X2.2
  Bottom 0.406: 61.92,83.88 65.66,83.88 65.9,83.88 66.17,84.15 | 66.8,73.66 67.31,74.17 | BSPD1:U$4.4 67.98,70.3 67.31,70.97 | v68.28,86.26 66.17,84.15 | 66.17,84.15 66.17,83.88 | BSPD1:D2.A 85.85,47.1 BSPD1:U$6.3 | BSPD1:U$5.3 81.53,48.94 80.82,48.23 | U$3.2 v55.75,76.45 | v25.4,117.78 23.04,117.78 v22.99,117.73 | BSPD1:D1.A 82.55,92.59 82.55,97.66 83.57,98.68 83.57,99.82 81.79,101.6 BSPD1:CALIBRATE1.3 | D3.A 43.93,50.92 v43.88,50.86 | U$3.8 59.12,83.88 v59.44,83.82 | 37.72,116.2 38.35,116.84 v39.5,116.84 | U$2.P$1 85.85,118.87 82.17,122.56 v77.09,122.56 | BSPD1:C1.2 83.81,65.66 81.28,65.66 | v68.07,59.05 68.96,59.05 | BSPD1:R1.1 80.53,79.64 v79.76,78.87 | BSPD1:C3.1 80.39,60.82 v80.78,60.82 | 81.79,69.71 BSPD1:C2.1 81.92,68.58 81.28,67.94
  Bottom 0.61: 52.07,40.64 47.87,44.84 PEDALS.2 43.88,49.67 v43.88,50.86 | PEDALS.8 52.07,40.64 | 52.07,40.64 54.36,42.93 57.4,42.93 60.15,45.68 PEDALS.5 | v43.88,50.86 39.25,55.49 R6.1 34.19,55.36 v29.08,60.47 | X4.8 66.6,18.8 60.91,18.8 X4.5 | X2.2 49.37,64.41 SOFTWARE_SHUTOFF.1 | v59.44,83.82 59.5,83.88 65.66,83.88 66.17,83.88 67.31,82.74 67.31,80.2 | 67.31,80.2 BSPD1:U$12.4 | 67.31,80.2 67.31,74.17 67.31,70.97 67.31,62.3 BSPD1:U$10.4 68.96,59.05 70.64,57.38 v71.4,57.38 | BSPD1:CALIBRATE3.3 73.15,104.39 78.49,104.39 | 78.49,104.39 BSPD1:CALIBRATE1.3 | BSPD1:U$1.1 80.82,48.23 83.96,45.1 BSPD1:D2.A | v43.88,50.86 43.34,50.86 v35.41,42.8 | v89.28,82.04 93.34,77.98 97.16,77.98 99.19,80.01 POWER.8 | BSPD1:CALIBRATE2.3 92.2,103.38 91.19,104.39 78.49,104.39 | U$1.GND 59.05,102.87 v62.1,99.82 | v80.78,60.82 80.78,65.16 81.28,65.66 81.28,67.94 BSPD1:U$3.COIL+
  Bottom 1.27: X1.2 40.64,85.27 40.64,87.76 31.09,97.31 | v29.21,97.31 31.09,97.31 | 31.09,97.31 31.09,101.45 37.72,108.08 37.72,116.2 37.72,117.35 34.92,120.14 34.92,124.84 38.99,128.91 43.05,128.91 v44.96,130.81
INT  (via drill 0.4)
  Top 0.406: U$11.12 v31.75,120.4
  Bottom 0.406: PI_EVEN.11 4.29,105.46 6.45,105.46 7.72,106.73 7.72,108.1 11.68,112.06 11.68,119.99 12.09,120.4 v31.75,120.4
LED1  (via drill 0.4)
  Top 0.406: LED4.A 29.69,64.36 v29.69,67.74
  Bottom 0.406: v29.69,67.74 23.42,67.74 11.35,79.81 11.35,90.78 PI_ODD.8
LED2  (via drill 0.45)
  Top 0.406: LED6.A 23.88,64.89 v23.88,64.9
  Bottom 0.406: PI_ODD.7 9.92,89.67 9.92,78.85 v23.88,64.9
MISO  (via drill 0.4)
  Top 0.406: v27.94,118.87 U$11.15
  Bottom 0.406: v27.94,118.87 27.94,112.78 24.96,109.79 24.96,103.06 22.61,100.71 9.04,100.71 PI_ODD.11
MISO_TEENSY  (via drill 0.4)
  Top 0.406: v39.62,50.93 41.27,50.93 41.91,51.56 41.91,61.47 46.86,66.42 v52.07,66.42 | U$18.12 31.12,32.38 v30.04,33.47
  Bottom 0.406: v39.62,50.93 38.23,50.93 28.32,41.02 28.32,35.18 v30.04,33.47 | 52.2,66.42 v52.07,66.42 49.28,69.22 U$1.D12
MOSI  (via drill 0.4)
  Top 0.406: U$11.14 v29.21,118.87
  Bottom 0.406: v29.21,118.87 29.21,112.65 26.04,109.47 26.04,102.62 23.24,99.82 7.39,99.82 PI_ODD.10
MOSI_TEENSY  (via drill 0.4)
  Top 0.406: U$18.11 32.03,33.66 v30.24,35.44 | v40.64,52.7 40.64,61.47 46.61,67.44 51.05,67.44 52.32,68.71 v52.2,68.71
  Bottom 0.406: v30.24,35.44 30.24,41.67 38.48,49.91 40.64,49.91 v40.64,52.7 | v52.2,68.71 52.2,69.47 U$1.D11
N$1
  Top 0.406: R7.1 U$6.9
N$2
  Bottom 0.406: U$3.4 53.21,78.87 51.18,80.9 51.18,88.65 49.66,90.17 U$1.D4(CANRX)
N$3
  Top 0.406: R8.1 6.48,61.35 U$6.11
N$4
  Top 0.406: U$20.2 19.19,49.58 20.07,48.7 22.3,48.7 | U$4.16 26.29,48.64 25.02,47.37 23.63,47.37 22.3,48.7 | 22.3,48.7 U$9.2
N$5
  Bottom 0.406: U$3.1 57.02,80.77 55.78,82.02 51.94,82.02 51.94,90.17 49.4,92.71 U$1.D3(CANTX)
N$6
  Top 0.406: U$22.2 19.19,52.84 19.94,53.59 22.23,53.59 U$21.2 23.63,52.45 U$4.14
N$7
  Top 0.406: R14.1 R13.1 32.76,18.8 34.1,20.14 34.1,22.04 34.67,22.61 U$23.3
N$8  (via drill 0.4)
  Top 0.406: v45.72,54.1 45.18,53.56 LED8.A
  Bottom 0.406: R12.2 46.61,54.99 v45.72,54.1
N$9
  Top 0.406: R29.2 LED9.A
N$11
  Top 0.406: BR_FILTR.1 28.31,25.79 29.08,25.02 32.13,25.02 32.64,24.51 32.64,23.5 31.75,22.61 U$23.6 U$23.7
N$12  (via drill 0.45)
  Bottom 0.406: v49.4,47.5 48.13,48.77 48.13,50.77 SOFTWARE_SHUTOFF.2 49.54,52.67 R12.1
  Bottom 0.61: U$5.3 40.64,64.09 40.64,56.64 44.57,52.72 D3.C 49.49,52.72 SOFTWARE_SHUTOFF.2
N$13
  Top 0.406: U$24.1 U$24.2 51.69,21.84 | AC2_FILTR.1 50.81,23.36 51.69,22.48 51.69,21.84 | JMP1.2 54.74,27.31 54.74,24.89 51.69,21.84
N$14
  Top 0.61: R2.2 LED1.C
N$15
  Top 0.61: LED2.C R3.2
N$16
  Top 0.61: LED3.C R4.2
N$17  (via drill 0.4)
  Top 0.406: U$24.6 U$24.7 51.69,13.84 v51.05,13.21 | AC1_FILTR.1 v52.58,6.1 53.98,4.7 JMP2.2
  Bottom 0.406: v52.58,6.1 51.05,7.62 v51.05,13.21
N$19
  Top 0.406: U$6.7 5.21,71.2 10.24,76.22 R15.2
N$22
  Bottom 0.61: U$5.2 38.86,58.85 R6.2
N$24
  Top 0.406: U$6.5 7.75,70.84 11.1,74.19 R16.2
N$27
  Top 0.406: U$4.3 R21.2
N$28
  Top 0.406: U$6.3 10.29,71.09 11.3,72.11 R17.2
N$29
  Top 0.406: U$6.1 R18.2
N$31
  Top 0.406: U$4.7 33.16,57.53 R19.2
N$32
  Top 0.406: U$4.5 33.5,54.99 35.05,56.54 R20.2
N$35
  Top 0.406: U$4.1 31.75,49.01 R22.2
N$37
  Top 0.406: U$11.1 24.13,119.19 U$10.1
N$39  (via drill 0.4)
  Top 0.406: v25.4,116.33 U$11.2 | v16.26,119.38 16.45,119.19 U$10.4
  Bottom 0.406: v25.4,116.33 19.3,116.33 v16.26,119.38
N$40  (via drill 0.4)
  Top 0.406: v33.02,116.08 U$11.8 | v33.02,111 33.02,104.1 35.31,101.82 35.31,100.08 37.02,98.36 C6.2 40.06,98.36 CRYSTAL.2
  Bottom 0.406: v33.02,111 v33.02,116.08
N$41
  Top 0.406: U$10.8 21.21,115.57 20.57,116.2 16.64,116.2 14.99,117.86 11.56,117.86 9.58,115.88 R24.2
N$42  (via drill 0.45)
  Top 0.406: 39.13,105.66 C7.2 | CRYSTAL.1 39.13,105.66 | v33.91,118.62 31.75,116.46 U$11.7 | v35.56,109.22 35.57,109.22 39.13,105.66
  Bottom 0.406: v33.91,118.62 34.8,117.73 34.8,109.98 v35.56,109.22
N$43
  Top 0.406: R5.1 45.73,114.76 C3.2
N$50
  Top 0.406: C4.2 R23.1
N$52
  Top 0.406: LED4.C R25.1
N$53
  Top 0.406: LED5.C R26.1
N$54
  Top 0.406: 25.73,64.85 LED6.C 26.04,64.83 R27.1
N$61
  Top 0.61: LED7.C R28.1
READ_ACCEL1  (via drill 0.4)
  Top 0.406: U$26.P$1 54.85,9.53 AC1_FILTR.2 C10.1 48.25,9.53 v47.75,10.03 | U$18.1 40.2,27.3 46.99,20.52 v46.99,13.59
  Bottom 0.406: v46.99,13.59 46.99,10.79 v47.75,10.03
READ_ACCEL2
  Top 0.406: U$18.2 41.66,28.57 44.83,25.4 C9.1 AC2_FILTR.2 U$25.P$1
READ_BRAKE  (via drill 0.4)
  Top 0.406: U$18.3 38.86,29.84 37.97,28.96 v37.97,28.07 | C12.2 BR_FILTR.2 33.91,26.29 v35.05,25.15
  Bottom 0.406: v35.05,25.15 v37.97,28.07
READ_CHARGE  (via drill 0.4, 0.45)
  Top 0.406: LED2.A 72.39,89.92 v73.28,89.03 73.66,88.65 73.66,82.55 v73.79,82.42 73.79,80.39 72.9,79.5 72.9,68.96 72.14,68.2 72.14,66.29 73.22,65.22 73.22,62.55 75.82,59.94 v75.82,58.17 | v54.61,124.16 54.61,117.6 66.55,105.66 66.55,99.44 v66.23,99.12 | U$18.6 38.48,33.66 37.85,34.29 37.85,37.34 42.55,42.04 48.13,42.04 49.78,43.69 53.09,43.69 54.1,44.7 54.1,46.61 55.63,48.13 56.39,48.13 59.44,51.18 59.44,56.13 v60.07,56.77
  Bottom 0.406: BSPD1:U$12.1 BSPD1:U$12.2 72.77,81.41 v73.79,82.42 | v73.28,89.03 63.12,89.03 62.48,89.66 62.48,95.76 63.25,96.52 65.79,96.52 66.23,96.97 v66.23,99.12 | v54.61,124.16 54.48,124.28 54.48,126.87 57.15,129.54 72.64,129.54 77.22,134.11 90.42,134.11 U$16.P$1 | v60.07,56.77 60.31,56.53 72.15,56.53 72.16,56.52 74.8,56.52 75.82,57.53 v75.82,58.17
READ_FAULT  (via drill 0.4, 0.45, 0.5)
  Top 0.406: v74.14,106.81 74.14,106.7 69.88,106.7 68.2,105.03 68.2,99.57 v68.45,99.31 | X5.5 80.82,119.94 85.6,124.71 U$15.P$1 | 89.5,79.63 89.5,72.94 v90.87,71.56 | v92.2,60.45 95.25,57.4 v97.41,57.4 | v42.8,36.32 41.4,34.92 U$18.7 | v62.99,37.85 v68.96,37.85 | POWER.5 91.31,85.19 91.31,81.44 89.5,79.63 | LED3.A 75.06,90.01 v75.06,88.9 74.32,88.16 74.32,83.42 76.43,81.31 76.43,78.98 77.34,78.07 80.14,78.07 82.82,80.75 88.37,80.75 89.5,79.63
  Bottom 0.406: v74.14,106.81 80.77,113.44 X5.5 | v92.2,60.45 92.2,64.26 90.87,65.6 v90.87,71.56 | v97.41,57.4 97.41,52.45 82.8,37.85 v68.96,37.85 | v42.8,36.32 61.47,36.32 v62.99,37.85 | v68.45,99.31 69.34,98.42 73.15,98.42 75.06,96.52 v75.06,88.9 74.93,88.9 72.77,86.74 BSPD1:U$12.7 BSPD1:U$12.6
READ_SWITCH  (via drill 0.4, 0.45)
  Top 0.406: v97.1,66.8 95.08,64.78 90,64.78 87.55,62.33 80.62,62.33 78.5,60.21 78.5,57.57 76.94,56.01 74.17,56.01 70.55,59.63 | LED1.A v67.56,90.14 67.07,89.64 67.07,85.99 68.53,84.53 68.53,68 67.44,66.9 67.44,62.74 70.55,59.63 | v67.31,98.3 67.31,111.51 60.2,118.62 60.2,123.14 X5.6 | 70.55,59.63 70.55,56.2 v73.28,53.47 69.85,50.04 69.85,36.96 67.69,34.8 v59.94,34.8 | U$18.5 40.89,32.38 v43.31,34.8
  Bottom 0.406: v97.1,66.8 100.03,69.73 POWER.6 | U$17.P$1 96.01,131.83 93.73,129.54 74.3,129.54 73.28,128.52 59.99,128.52 X5.6 | BSPD1:U$6.4 85.36,50.29 81.03,50.29 80.26,51.05 80.26,52.2 78.99,53.47 v73.28,53.47 | v67.56,90.14 66.29,91.41 66.29,94.87 67.31,95.89 v67.31,98.3 | v43.31,34.8 v59.94,34.8
READ_UPSTREAM_SHUTDOWN
  Top 0.406: U$18.4 38.86,31.11 36.83,29.08 36.83,27.3 37.97,26.16 37.97,22.35 36.96,21.34 U$23.2 U$23.1
SCK
  Top 0.406: U$11.13 30.48,124.77 29.08,126.16 25.5,126.16 21.06,130.61 13.18,130.61 7.09,124.51 7.09,108.38 5.56,106.86 PI_ODD.12
SCK_TEENSY  (via drill 0.4)
  Top 0.406: U$1.D13 64.77,69.6 64.77,61.21 65.53,60.45 v65.53,45.34 | U$18.13 35.94,31.11 37.72,32.89 v37.72,33.02
  Bottom 0.406: v65.53,45.34 65.53,37.59 60.96,33.02 v37.72,33.02
SCL  (via drill 0.4)
  Top 0.406: v59.82,89.79 59.82,108.58 49.58,118.82 49.58,126.03 v50.42,126.87
  Bottom 0.406: U$1.A5 v59.82,89.79 58.66,90.94 R31.1 | v50.42,126.87 51.18,127.64 51.18,132.46 49.4,134.24 ADXL345_BREAKOUT.9
SDA  (via drill 0.4)
  Top 0.406: U$1.A4 v61.98,85.09 | v57.08,92.27 57.08,110.3 48.9,118.49 48.9,126.75 v50.16,128.02
  Bottom 0.406: R32.1 v57.08,92.27 57.08,89.98 v61.98,85.09 | v50.16,128.02 50.16,131.95 47.88,134.24 47.88,136.78 49.02,137.92 51.44,137.92 51.94,137.41 ADXL345_BREAKOUT.8
SHUTDOWN_A  (via drill 0.4, 0.9)
  Top 0.406: v72.9,51.18 72.01,50.29 v72.01,35.31 | R13.2 35.69,17.91 40.13,13.46 45.72,13.46 46.99,12.19 v51.94,12.19 | v53.98,12.19 54.86,13.08 v54.86,16.51 | v54.86,23.5 56.26,24.89 56.26,26.29 v56.77,26.8
  Top 1.778: POWER.1 97.59,74.67 97.59,92.81 89.15,101.24 89.15,102.21 77.83,113.54 v77.6,113.54
  Bottom 0.406: 58.95,55.11 59.92,55.11 | v72.9,51.18 69.34,54.74 69.34,55.11 | v54.86,16.51 v54.86,23.5 | v72.01,35.31 63.5,26.8 v56.77,26.8 | v51.94,12.19 v53.98,12.19
  Bottom 1.778: POWER.1 93.88,70.96 93.88,58.8 90.17,55.09 88.9,55.09 76.45,55.1 69.34,55.11 61.8,55.11 59.92,55.11 53.59,55.12 50.29,58.42 SOFTWARE_SHUTOFF.P | v77.6,113.54 61.85,113.54 57.4,117.98 X5.1
SHUTDOWN_B  (via drill 0.4)
  Top 0.406: R29.1 67.44,51.17 v67.44,50.42
  Bottom 0.406: v67.44,50.42 65.43,52.43 65.28,52.43
  Bottom 1.778: SOFTWARE_SHUTOFF.S 65.28,52.43 68.53,52.43 BSPD1:U$1.P
SHUTDOWN_D
  Top 1.778: X5.2 63.96,119.94 78.49,105.41 78.49,100.08 83.57,95 83.57,88.16 BSPD1:U$3.7
  Bottom 1.778: POWER.2 92.85,75.81 87,81.66 BSPD1:U$3.7
SHUTDOWN_RELAY_CTRL
  Bottom 0.406: U$5.1 45.16,62.61 51.56,62.61 53.85,64.9 53.85,66.8 U$1.A2
SIGNAL_ACCEL1
  Top 0.406: U$24.5 49.15,16.13 50.67,17.65 54.99,17.65 56.19,18.85 60.71,18.85 | ACC1_PD.1 ACC1_PU.1 | JMP2.1 62.24,9.78 71.37,9.78 72.52,10.92 72.52,12.19 71.75,12.95 66.55,12.95 63.7,15.8
  Top 0.61: 63.7,15.8 X4.9 60.71,18.85 60.71,27.94 | PEDALS.9 56.27,32.38 60.71,27.94 | ACC1_PU.1 60.71,27.94
SIGNAL_ACCEL2  (via drill 0.4)
  Top 0.406: PEDALS.6 46.56,37.29 v46.56,27.18 49.4,27.18 51.05,28.82 JMP1.1 | ACC2_PD.1 ACC2_PU.1 78.36,25.52 78.36,18.72 X4.6 | U$24.3 v50.42,22.23
  Bottom 0.406: X4.6 81.2,15.8 75.82,10.41 59.44,10.41 47.62,22.23 | v46.56,27.18 46.56,23.29 47.62,22.23 | v50.42,22.23 47.62,22.23
SIGNAL_BRAKE  (via drill 0.4, 0.45, 0.5, 0.6)
  Top 0.406: 84.47,111.85 v79.49,116.83 | 84.47,111.85 90.55,105.77 v90.55,103.25 | 84.47,111.85 96.66,111.85 U$13.P$1 | v87.63,100.35 87.63,99.44 90.47,96.6 v90.47,85.8 | 70.87,23.11 70.87,23.37 | 70.75,26.53 70.87,26.42 | U$23.5 v28.7,23.88 | v76.58,61.21 79.12,63.75 82.8,63.75 v86.74,67.69
  Top 0.61: v70.87,45.72 v70.87,35.81 70.87,26.42 70.87,23.37 70.87,23.06 X4.3
  Bottom 0.406: POWER.4 92.07,84.21 v90.47,85.8 89.41,86.87 85.6,86.87 84.84,86.11 84.84,80.14 88.77,76.2 88.77,73.66 | 88.77,73.66 95.76,73.66 97.54,75.44 97.54,76.58 98.81,77.85 100.97,77.85 101.85,76.96 101.85,55.75 83.06,36.96 72.01,36.96 v70.87,35.81 | v87.63,100.35 90.53,103.25 v90.55,103.25 | v86.74,67.69 88.14,67.69 88.77,68.33 88.77,73.66 | X4.3 72.44,24.64 83.06,24.64 84.33,23.37 84.33,14.86 78.99,9.53 59.05,9.53 54.1,14.48 30.99,14.48 26.29,19.18 26.29,21.46 v28.7,23.88 | X5.4 76.38,119.94 v79.49,116.83 | BSPD1:R12.1 v76.58,61.21
  Bottom 0.61: PEDALS.3 54.27,47.88 68.71,47.88 v70.87,45.72
SIGNAL_CURRENT  (via drill 0.4, 0.5)
  Top 0.406: v94.08,99.62 98.15,99.62 99.67,101.14 U$14.P$1 | v84.58,96.9 83.82,96.9 79.88,100.84 79.88,106.43 69.09,117.22 X5.3 | v86.23,74.3 84.45,72.52 v84.45,68.45
  Bottom 0.406: 84.58,87.88 v84.58,96.9 91.36,96.9 v94.08,99.62 | 84.58,87.88 89.41,87.88 91.95,90.42 96.01,90.42 96.52,89.92 96.52,82 POWER.3 | 84.58,87.88 83.82,87.12 83.82,80.15 87,76.97 87,75.06 v86.23,74.3 | v84.45,68.45 BSPD1:R10.1

## Text on the board
tDocu: Fault | Charge | Switch | Fault Brake | Input Brake | GND | Fault Current | Input Current | HyTech 2018 Front ECU rev7 | Time | Brake | Current | SW | CH | FAULT | BR | CUR | SHUTDOWN B | RELAY | BSPD ENABLE | ACCEL2 | ACCEL1